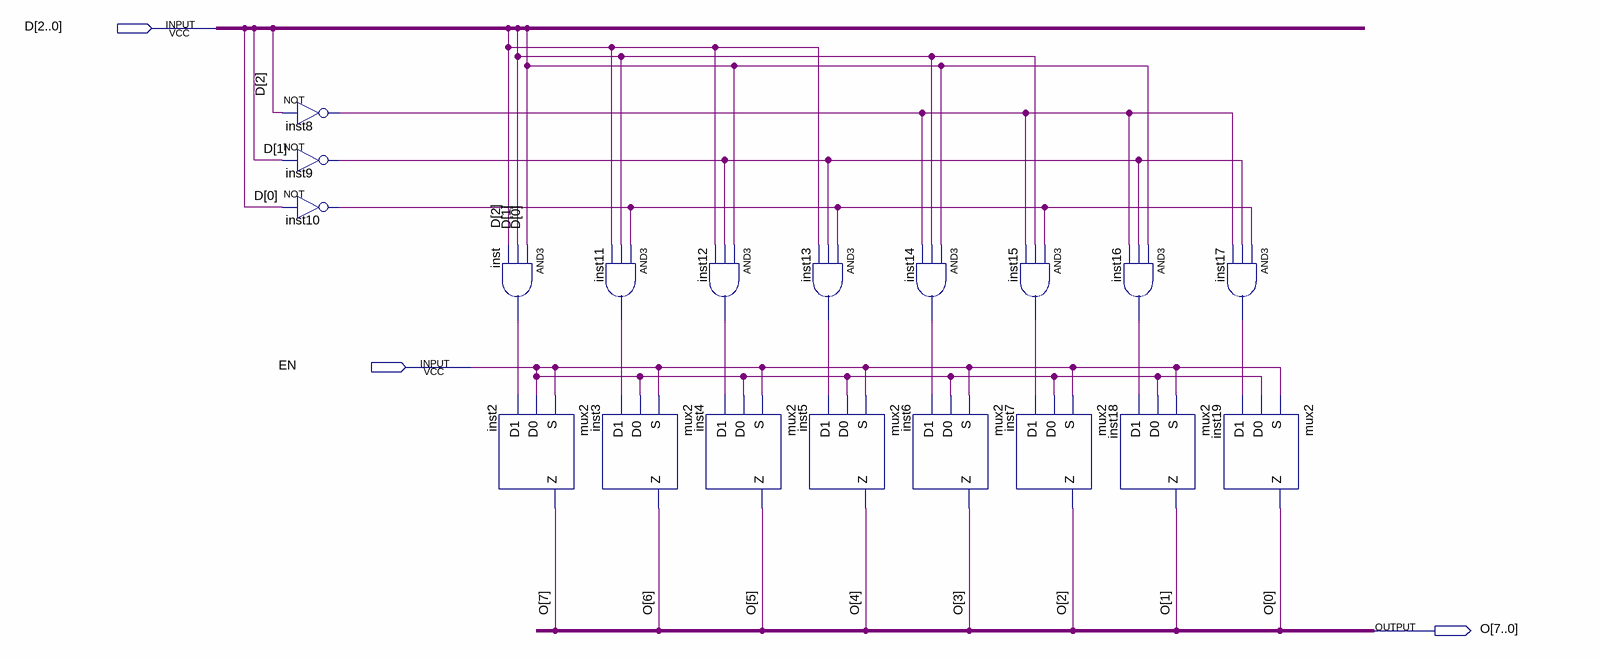
[diagram p0: schematic sheet]
// Quartus schematic decoder3to8.bdf as structural Verilog: 19 symbols, 3 pins
module decoder3to8 (
  input  [2:0] D,
  input  EN,
  output [7:0] O
);

  wire inst8_out, inst9_out, inst10_out, inst11_out, inst12_out, inst13_out, inst14_out, inst15_out,
       inst16_out, inst17_out, inst_out;

  not inst8 (inst8_out, D[2]);
  not inst9 (inst9_out, D[1]);
  not inst10 (inst10_out, D[0]);
  and inst (inst_out, D[0], D[1], D[2]);
  mux2 inst2 (.S(EN), .D0(EN), .D1(inst_out), .Z(O[7]));
  and inst11 (inst11_out, inst10_out, D[1], D[2]);
  mux2 inst3 (.S(EN), .D0(EN), .D1(inst11_out), .Z(O[6]));
  and inst12 (inst12_out, D[0], inst9_out, D[2]);
  mux2 inst4 (.S(EN), .D0(EN), .D1(inst12_out), .Z(O[5]));
  and inst13 (inst13_out, inst10_out, inst9_out, D[2]);
  mux2 inst5 (.S(EN), .D0(EN), .D1(inst13_out), .Z(O[4]));
  and inst14 (inst14_out, D[0], D[1], inst8_out);
  mux2 inst6 (.S(EN), .D0(EN), .D1(inst14_out), .Z(O[3]));
  and inst15 (inst15_out, inst10_out, D[1], inst8_out);
  mux2 inst7 (.S(EN), .D0(EN), .D1(inst15_out), .Z(O[2]));
  mux2 inst18 (.S(EN), .D0(EN), .D1(inst16_out), .Z(O[1]));
  and inst16 (inst16_out, D[0], inst9_out, inst8_out);
  and inst17 (inst17_out, inst10_out, inst9_out, inst8_out);
  mux2 inst19 (.S(EN), .D0(EN), .D1(inst17_out), .Z(O[0]));
endmodule
